# EAGLE design board (EAGLE 7.6.0)
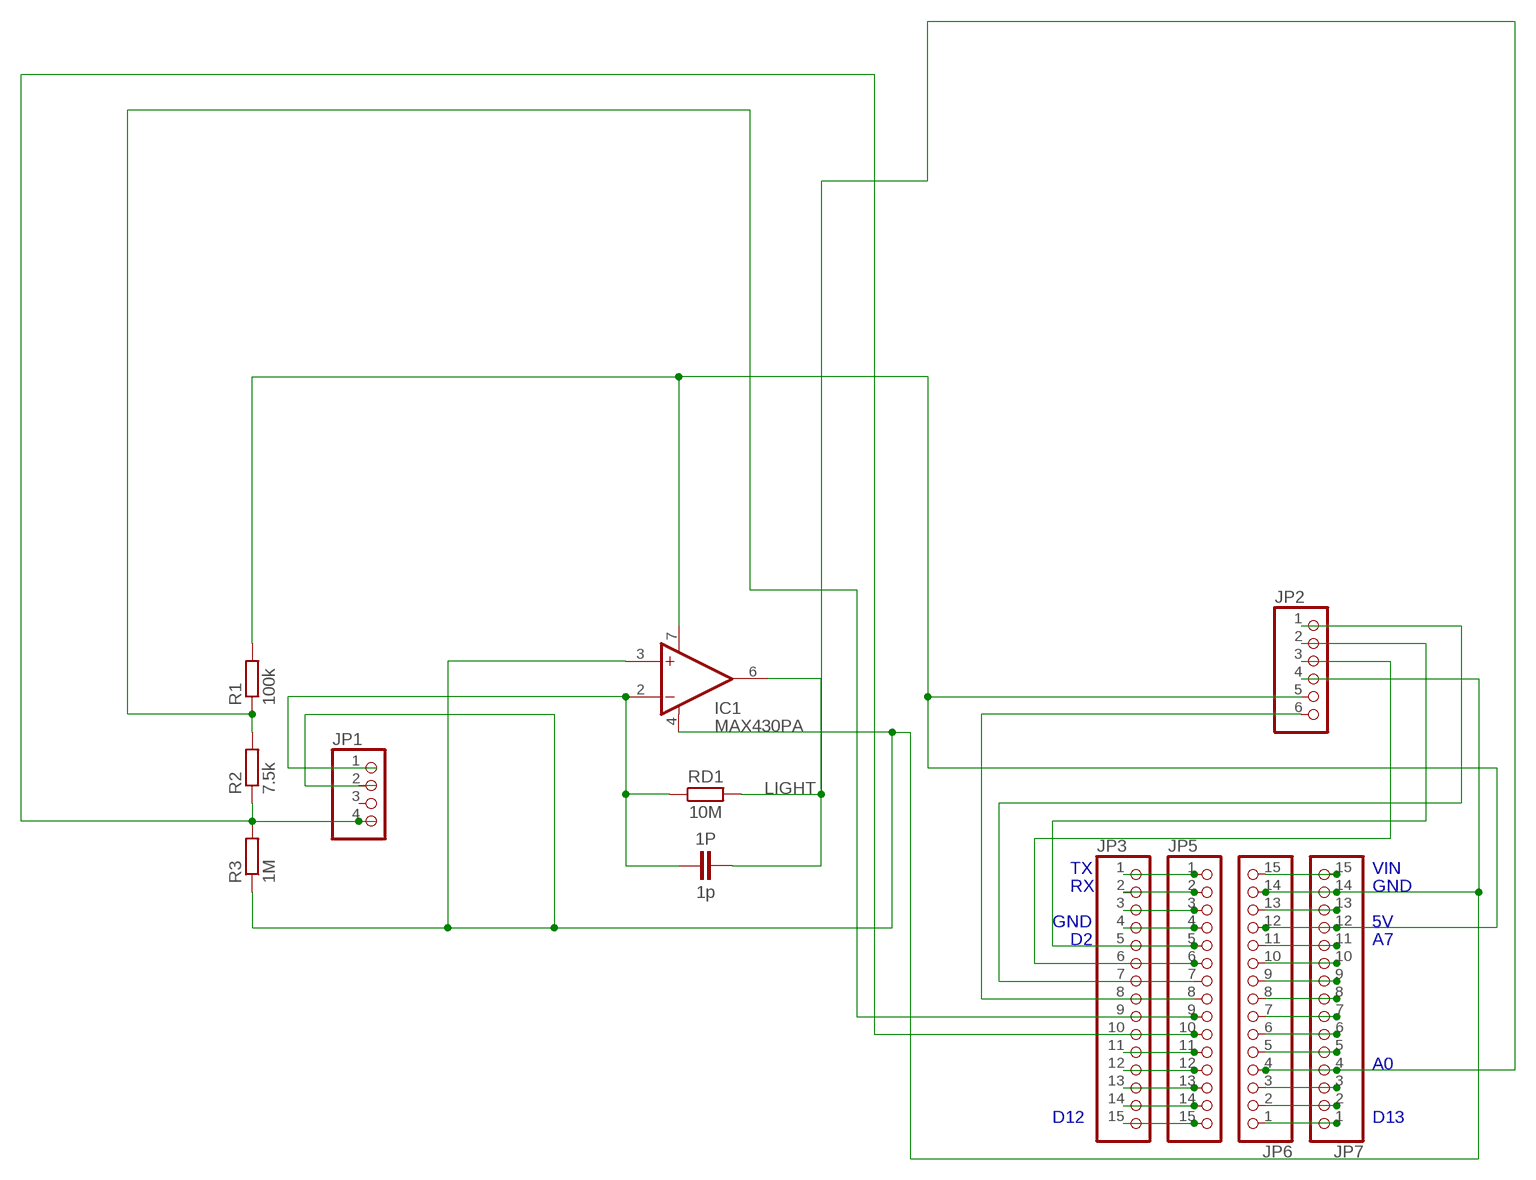
[diagram p0: schematic, sheet 1]

## Parts
1P  1p  CAPACITOR1206  [1206]
IC1  MAX430PA  [DIL08]
JP1  PINHD-1X4  [1X04]
JP2  PINHD-1X6  [1X06]
JP3  PINHD-1X15  [1X15]
JP5  PINHD-1X15  [1X15]
JP6  PINHD-1X15  [1X15]
JP7  PINHD-1X15  [1X15]
R1  100k  R-EU_R1206  [R1206]
R2  7.5k  R-EU_R1206  [R1206]
R3  1M  R-EU_R1206  [R1206]
RD1  10M  RESISTOR1206  [1206]

## Nets
LIGHT: 1P.2 IC1.6(OUT) JP6.4 JP7.4 RD1.2
N$1: JP3.9 JP5.9 R1.1 R2.2
N$2: JP1.4 JP3.10 JP5.10 R2.1 R3.2
N$3: JP2.1 JP3.7 JP5.7
N$4: JP2.2 JP3.5 JP5.5
N$5: IC1.3(+IN) IC1.4(V-) JP1.2 JP2.4 JP6.14 JP7.14 R3.1
N$6: JP6.1 JP7.1
N$7: JP6.2 JP7.2
N$8: 1P.1 IC1.2(-IN) JP1.1 RD1.1
N$9: JP2.6 JP3.8 JP5.8
N$10: JP2.3 JP3.6 JP5.6
N$11: JP6.3 JP7.3
N$13: JP6.5 JP7.5
N$14: JP6.6 JP7.6
N$15: JP6.7 JP7.7
N$16: JP6.8 JP7.8
N$17: JP6.9 JP7.9
N$18: JP6.10 JP7.10
N$19: JP6.11 JP7.11
N$20: JP6.13 JP7.13
N$21: JP6.15 JP7.15
N$22: JP3.3 JP5.3
N$23: JP3.4 JP5.4
N$25: JP3.11 JP5.11
N$26: JP3.12 JP5.12
N$27: JP3.13 JP5.13
N$28: JP3.14 JP5.14
N$29: JP3.15 JP5.15
N$30: JP3.1 JP5.1
N$31: JP3.2 JP5.2
V0_3V3_1A0: IC1.7(V+) JP2.5 JP6.12 JP7.12 R1.2
Unconnected: JP1.3

## Notes on the sheet
- TX | VIN
- RX | GND
- GND | 5V
- D2 | A7
- A0
- D12 | D13

## Library data of the parts
1P = thar:CAPACITOR
IC1 = maxim:MAX430PA: OP AMP; OC_FARNELL: unknown; OC_NEWARK: unknown
JP1 = pinhead:PINHD-1X4: PIN HEADER
JP2 = pinhead:PINHD-1X6: PIN HEADER
JP3 JP5-JP7 = adafruit:PINHD-1X15: PIN HEADER
R1-R3 = resistor:R-EU_: RESISTOR, European symbol
RD1 = thar:RESISTOR

## Board
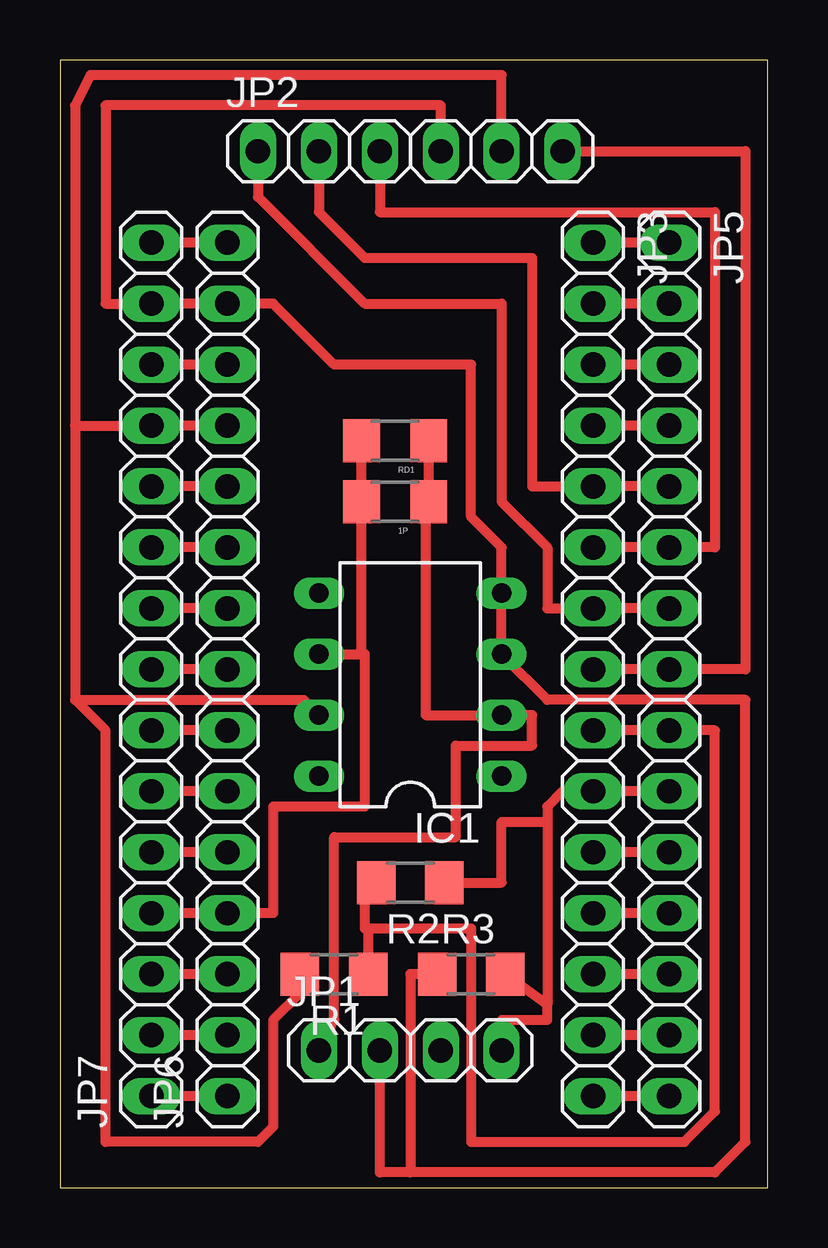
[diagram p1: board, top side]

Size 29.52 x 46.98 mm. Coordinates in mm from the lower left corner, seen from the top.
Outline: 0,0 29.52,0 29.52,46.98 0,46.98 0,0
Copper layers (1*16): Top 0.035mm / dielectric 1.5mm / Bottom 0.035mm
Design rules "default *": minimum track width 10mil, minimum drill 24mil, track to track 8mil, track to pad 8mil, pad to pad 8mil, via to via 8mil, smd to smd 8mil, copper to edge 40mil, drill to drill 8mil, minimum pad ring 10mil, minimum via ring 8mil, stop-mask expansion 4mil, vias tented up to drill 0mil, thermal gap 10mil

### Footprints (pad centres in the part's own frame; a part is rotated, then mirrored left to right if it is on the bottom)
1206 = smd 1.524 x 1.778: 1 -1.397,0; 2 1.397,0
DIL08 = drill 0.813 long: 1 -3.81,-3.81; 2 -1.27,-3.81; 3 1.27,-3.81; 4 3.81,-3.81; 5 3.81,3.81; 6 1.27,3.81; 7 -1.27,3.81; 8 -3.81,3.81
1X04 = drill 1.016 long: 1 -3.81,0; 2 -1.27,0; 3 1.27,0; 4 3.81,0
1X06 = drill 1.016 long: 1 -6.35,0; 2 -3.81,0; 3 -1.27,0; 4 1.27,0; 5 3.81,0; 6 6.35,0
1X15 = drill 1.016 long: 1 -17.78,0; 2 -15.24,0; 3 -12.7,0; 4 -10.16,0; 5 -7.62,0; 6 -5.08,0; 7 -2.54,0; 8 0,0; 9 2.54,0; 10 5.08,0; 11 7.62,0; 12 10.16,0; 13 12.7,0; 14 15.24,0; 15 17.78,0
R1206 = smd 1.6 x 1.803: 1 -1.422,0; 2 1.422,0

### Placement (x,y rotation side)
1P  13.97,28.57 180 top
IC1  14.6,20.96 90 top
JP1  14.6,5.71 0 top
JP2  14.6,43.18 0 top
JP3  22.22,21.59 270 top
JP5  25.4,21.59 270 top
JP6  6.98,21.59 90 top
JP7  3.81,21.59 90 top
R1  11.43,8.89 180 top
R2  14.6,12.7 180 top
R3  17.14,8.89 0 top
RD1  13.97,31.11 180 top

### Tracks (layer width: path | path; a pad name or v marks a point on that pad's centre or on a via)
LIGHT
  Top 0.406: JP7.4 JP6.4 8.89,11.43 8.89,15.87 12.7,15.87 12.7,22.22 | 12.7,22.22 12.57,22.35 1P.2 RD1.2 | IC1.6 12.7,22.22
N$1
  Top 0.406: JP3.9 JP5.9 27.3,19.05 27.3,3.17 26.03,1.9 17.14,1.9 17.14,10.79 12.85,10.79 | R2.2 12.7,12.7 12.7,10.79 12.85,10.79 | 12.85,10.79 R1.1
N$2
  Top 0.406: JP5.10 JP3.10 20.95,16.51 20.32,15.87 20.32,15.24 | 20.32,15.24 20.32,7.62 | 20.32,7.62 R3.2 19.05,8.41 | JP1.4 18.41,6.98 20.32,6.98 20.32,7.62 | R2.1 18.41,12.7 18.41,15.24 20.32,15.24
N$3
  Top 0.406: JP2.1 8.25,41.27 12.7,36.83 18.41,36.83 18.41,28.57 20.32,26.67 20.32,24.13 JP3.7 JP5.7
N$4
  Top 0.406: JP2.2 10.79,40.64 12.7,38.73 19.68,38.73 19.68,29.21 JP3.5 JP5.5
N$5
  Top 0.406: JP1.2 13.33,0.63 14.6,0.63 | 14.6,0.63 27.3,0.63 28.58,1.9 28.58,20.32 20.32,20.32 IC1.3 IC1.4 18.41,26.67 17.14,27.94 17.14,34.29 11.43,34.29 8.89,36.83 JP6.14 JP7.14 1.9,36.83 1.9,45.08 15.88,45.08 JP2.4 | R3.1 14.6,8.89 14.6,0.63
N$6
  Top 0.406: JP6.1 JP7.1
N$7
  Top 0.406: JP6.2 JP7.2
N$8
  Top 0.406: RD1.1 1P.1 15.24,28.45 15.24,19.68 IC1.2 19.68,19.68 19.68,18.41 16.51,18.41 16.51,14.6 11.43,14.6 11.43,6.98 JP1.1
N$9
  Top 0.406: JP2.6 28.58,43.18 28.58,21.59 JP5.8 | JP5.8 JP3.8 | JP5.8 26.03,21.59
N$10
  Top 0.406: JP2.3 13.33,40.64 27.3,40.64 27.3,26.67 JP5.6 JP3.6
N$11
  Top 0.406: JP6.3 JP7.3
N$13
  Top 0.406: JP6.5 JP7.5
N$14
  Top 0.406: JP6.6 JP7.6
N$15
  Top 0.406: JP6.7 JP7.7
N$16
  Top 0.406: JP6.8 JP7.8
N$17
  Top 0.406: JP6.9 JP7.9
N$18
  Top 0.406: JP6.10 JP7.10
N$19
  Top 0.406: JP6.11 JP7.11
N$20
  Top 0.406: JP6.13 JP7.13
N$21
  Top 0.406: JP6.15 JP7.15
N$22
  Top 0.406: JP5.3 JP3.3
N$23
  Top 0.406: JP5.4 JP3.4
N$25
  Top 0.406: JP5.11 JP3.11
N$26
  Top 0.406: JP5.12 JP3.12
N$27
  Top 0.406: JP5.13 JP3.13
N$28
  Top 0.406: JP5.14 JP3.14
N$29
  Top 0.406: JP5.15 JP3.15
N$30
  Top 0.406: JP5.1 JP3.1
N$31
  Top 0.406: JP5.2 JP3.2
V0_3V3_1A0
  Top 0.406: JP2.5 18.41,46.36 1.27,46.36 0.63,45.08 0.63,31.75 | 0.63,31.75 JP7.12 JP6.12 | 0.63,31.75 0.63,20.32 | 0.63,20.32 10.16,20.32 IC1.7 | R1.2 10.01,8.1 8.89,6.98 8.89,2.54 8.25,1.9 1.9,1.9 1.9,19.05 0.63,20.32